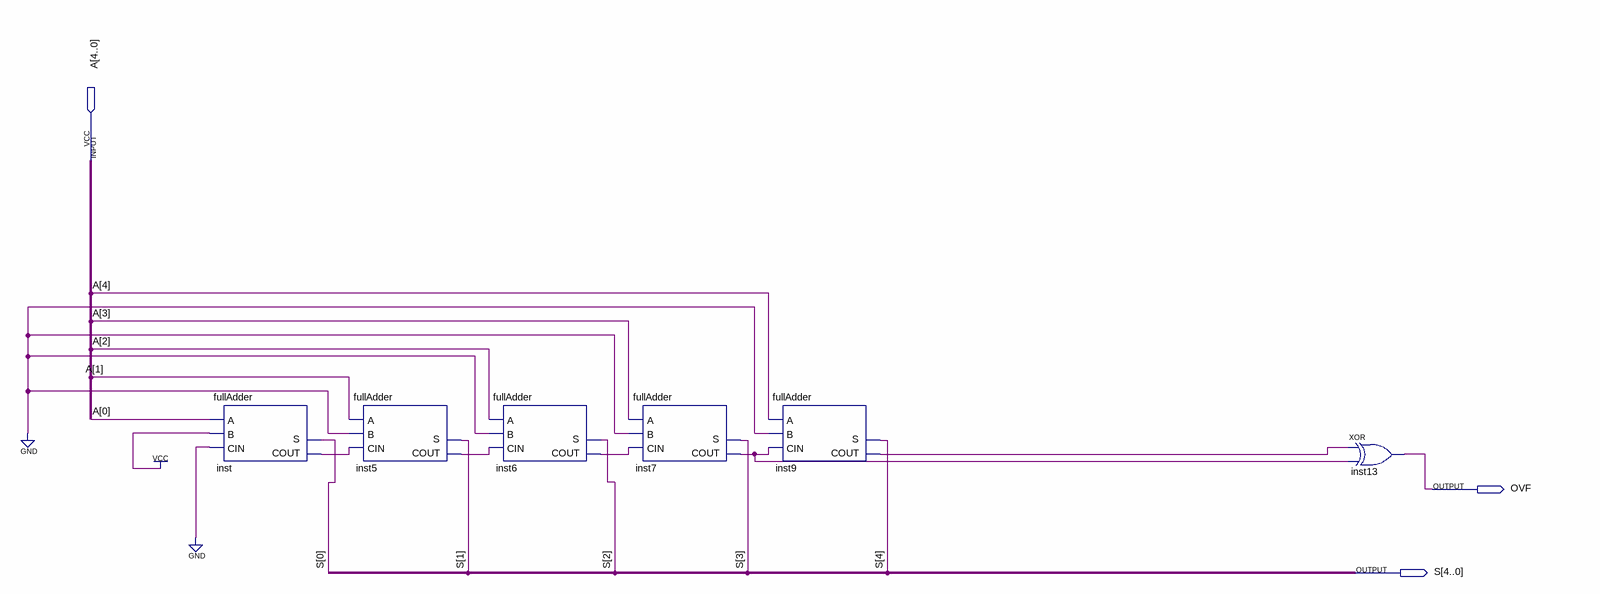
[diagram p0: schematic sheet]
// Quartus schematic sum1.bdf as structural Verilog: 6 symbols, 3 pins
module sum1 (
  input  [4:0] A,
  output OVF,
  output [4:0] S
);

  wire inst5_cout, inst6_cout, inst7_cout, inst9_cout, inst_cout;

  fullAdder inst (.A(A[0]), .B(1'b1), .CIN(1'b0), .S(S[0]), .COUT(inst_cout));
  fullAdder inst5 (.A(A[1]), .B(1'b0), .CIN(inst_cout), .S(S[1]), .COUT(inst5_cout));
  fullAdder inst6 (.A(A[2]), .B(1'b0), .CIN(inst5_cout), .S(S[2]), .COUT(inst6_cout));
  fullAdder inst7 (.A(A[3]), .B(1'b0), .CIN(inst6_cout), .S(S[3]), .COUT(inst7_cout));
  fullAdder inst9 (.A(A[4]), .B(1'b0), .CIN(inst7_cout), .S(S[4]), .COUT(inst9_cout));
  xor inst13 (OVF, inst9_cout, inst7_cout);
endmodule
